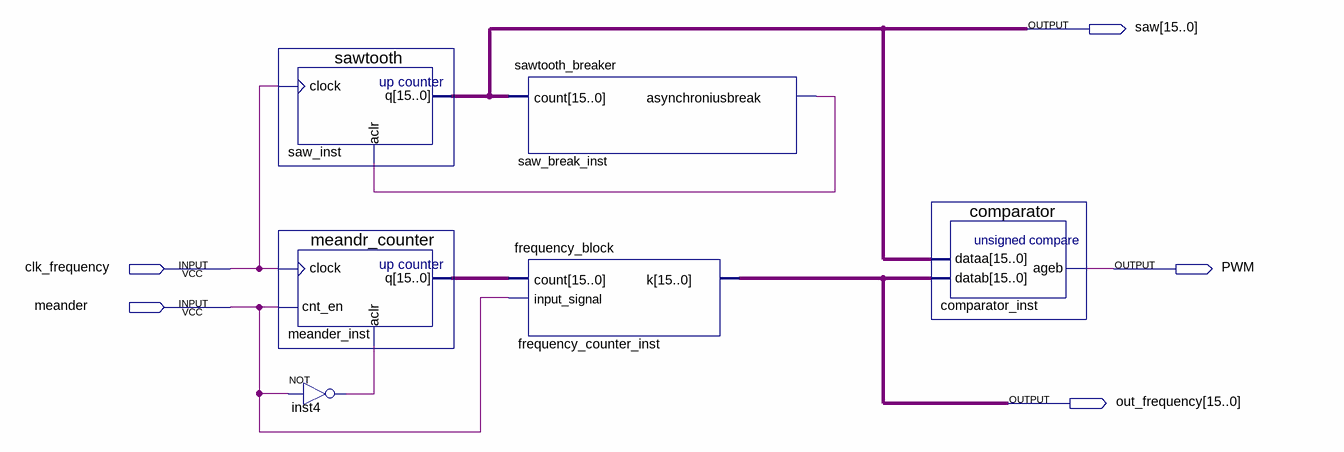
[diagram p0: schematic sheet]
// Quartus schematic pwm_controller.bdf as structural Verilog: 6 symbols, 5 pins
module pwm_controller (
  input  clk_frequency,
  input  meander,
  output [15:0] saw,
  output PWM,
  output [15:0] out_frequency
);

  wire inst4_out, saw_break_inst_asynchroniusbreak;
  wire [15:0] meander_inst_q;

  sawtooth saw_inst (.clock(clk_frequency), .aclr(saw_break_inst_asynchroniusbreak), .q(saw));
  meandr_counter meander_inst (.clock(clk_frequency), .cnt_en(meander), .aclr(inst4_out), .q(meander_inst_q));
  not inst4 (inst4_out, meander);
  sawtooth_breaker saw_break_inst (.count(saw), .asynchroniusbreak(saw_break_inst_asynchroniusbreak));
  frequency_block frequency_counter_inst (.count(meander_inst_q), .input_signal(meander), .k(out_frequency));
  comparator comparator_inst (.dataa(saw), .datab(out_frequency), .ageb(PWM));
endmodule
